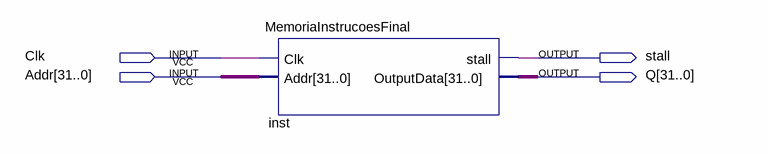
[diagram p0: schematic sheet]
// Quartus schematic TesteMemoriaInst.bdf as structural Verilog: 1 symbols, 4 pins
module TesteMemoriaInst (
  input  Clk,
  input  [31:0] Addr,
  output stall,
  output [31:0] Q
);

  MemoriaInstrucoesFinal inst (.Clk(Clk), .Addr(Addr), .stall(stall), .OutputData(Q));
endmodule
